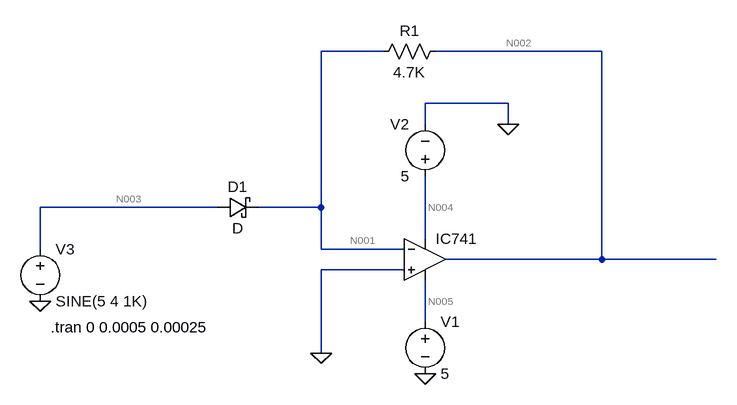
[diagram p0: schematic antilog.asc]
antilog.asc, the LTspice schematic file:
Version 4
SHEET 1 880 680
WIRE 304 -80 208 -80
WIRE 640 -80 384 -80
WIRE 496 0 368 0
WIRE 368 32 368 0
WIRE 496 32 496 0
WIRE 48 160 -224 160
WIRE 208 160 208 -80
WIRE 208 160 112 160
WIRE 368 208 368 112
WIRE -224 224 -224 160
WIRE 208 224 208 160
WIRE 336 224 208 224
WIRE 640 240 640 -80
WIRE 640 240 400 240
WIRE 816 240 640 240
WIRE 336 256 208 256
WIRE 368 336 368 272
WIRE 208 384 208 256
FLAG -224 304 0
FLAG 208 384 0
FLAG 368 416 0
FLAG 496 32 0
SYMBOL schottky 48 176 R270
WINDOW 0 32 32 VTop 2
WINDOW 3 0 32 VBottom 2
SYMATTR InstName D1
SYMBOL OpAmps\\UniversalOpamp2 368 240 R0
SYMATTR InstName IC741
SYMBOL voltage 368 320 R0
WINDOW 123 0 0 Left 0
WINDOW 39 0 0 Left 0
SYMATTR InstName V1
SYMATTR Value 5
SYMBOL voltage 368 128 R180
WINDOW 0 24 96 Left 2
WINDOW 3 24 16 Left 2
WINDOW 123 0 0 Left 0
WINDOW 39 0 0 Left 0
SYMATTR InstName V2
SYMATTR Value 5
SYMBOL voltage -224 208 R0
WINDOW 123 0 0 Left 0
WINDOW 39 0 0 Left 0
SYMATTR InstName V3
SYMATTR Value SINE(5 4 1K)
SYMBOL res 400 -96 R90
WINDOW 0 0 56 VBottom 2
WINDOW 3 32 56 VTop 2
SYMATTR InstName R1
SYMATTR Value 4.7K
TEXT -208 344 Left 2 !.tran 0 0.0005 0.00025

The netlist it stands for:
* antilog.asc
D1 N003 N001 D
XIC741 0 N001 N004 N005 N002 level.2 Avol=1Meg GBW=10Meg Slew=10Meg ilimit=25m rail=0 Vos=0 phimargin=45 en=0 enk=0 in=0 ink=0 Rin=500Meg  ; pins IN+ IN- V+ V- OUT
V1 N005 0 5
V2 N004 0 5
V3 N003 0 SINE(5 4 1K)
R1 N002 N001 4.7K
.model D D
.lib standard.dio
.tran 0 0.0005 0.00025
.lib UniversalOpamps2.sub
.backanno
.end

* Results of the author's LTspice run, read from the files saved beside the schematic
* Operating Point, zero values left out:
*   V(n003) = 5 V
*   V(n001) = 5 V
*   V(n002) = 5 V
*   V(n004) = 5 V
*   V(n005) = 5 V
*   I(V2) = -30 nA
*   I(V1) = -30 nA
*   Ix(ic741:1) = -10 nA
*   Ix(ic741:3) = 30 nA
*   Ix(ic741:4) = 30 nA
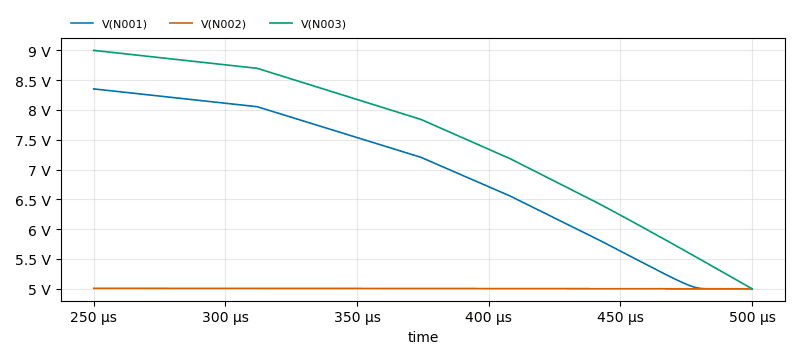
[diagram p1: Transient Analysis of antilog.asc, plotted from the saved traces]
* Transient Analysis, 1 run:
*   V(N001): min 5 V, max 8.354 V, average 6.924 V, rms 7.021 V, last 5 V
*   V(N002): min 5 V, max 5.008 V, average 5.004 V, rms 5.004 V, last 5 V
*   V(N003): min 5 V, max 9 V, average 7.521 V, rms 7.622 V, last 5 V